# EAGLE design Serial Card V3 (EAGLE 6.6.0)
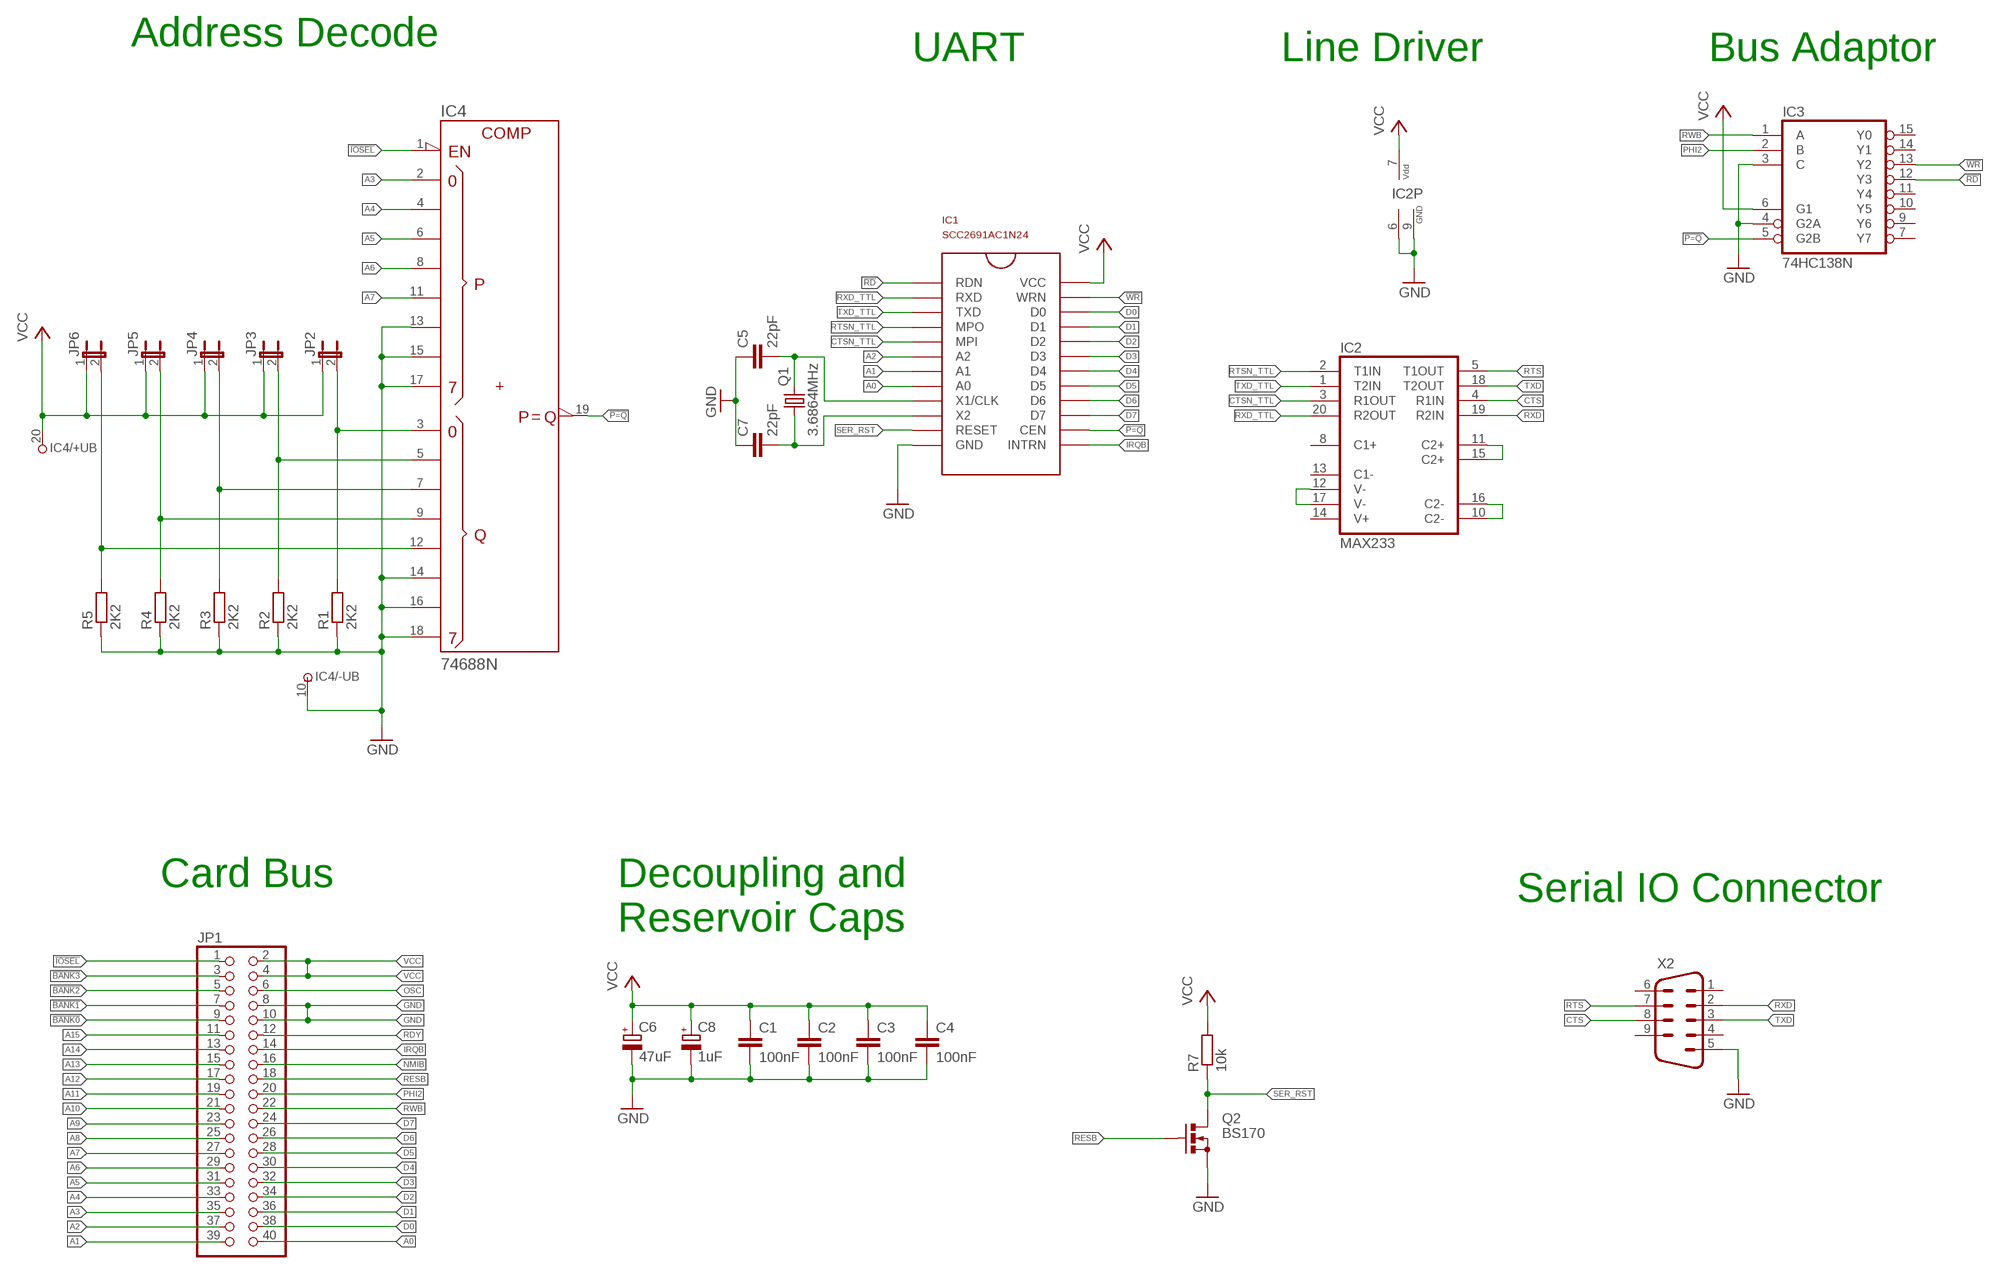
[diagram p0: schematic, sheet 1]

## Parts
C1  100nF  C-EU050-025X075  [C050-025X075]
C2  100nF  C-EU050-025X075  [C050-025X075]
C3  100nF  C-EU050-025X075  [C050-025X075]
C4  100nF  C-EU050-025X075  [C050-025X075]
C5  22pF  C-EU025-024X044  [C025-024X044]
C6  47uF  CPOL-EUE2.5-7  [E2,5-7]
C7  22pF  C-EU025-024X044  [C025-024X044]
C8  1uF  CPOL-EUE5-5  [E5-5]
IC1  SCC2691AC1N24  [DIP]
IC2  MAX233  [DIL20]
IC3  74HC138N  [DIL16]
IC4  74688N  [DIL20]
JP1  PINHD-2X20/90  [2X20/90]
JP2  JP1E  [JP1]
JP3  JP1E  [JP1]
JP4  JP1E  [JP1]
JP5  JP1E  [JP1]
JP6  JP1E  [JP1]
Q1  3.6864MHz  CRYSTALHC49S  [HC49/S]
Q2  BS170  [SOT54E]
R1  2K2  R-EU_0207/2V  [0207/2V]
R2  2K2  R-EU_0207/2V  [0207/2V]
R3  2K2  R-EU_0207/2V  [0207/2V]
R4  2K2  R-EU_0207/2V  [0207/2V]
R5  2K2  R-EU_0207/2V  [0207/2V]
R7  10k  R-EU_0207/2V  [0207/2V]
X2  M09HP  [M09HP]

## Nets
!BANK0: JP1.9
!BANK1: JP1.7
!BANK2: JP1.5
!BANK3: JP1.3
!IOSEL: IC4.1(!G) JP1.1
!P=Q: IC1.CEN IC3.5(G2B) IC4.19(!P=Q)
!RD: IC1.RDN IC3.12(Y3)
!WR: IC1.WRN IC3.13(Y2)
A0: IC1.A0 JP1.40
A1: IC1.A1 JP1.39
A2: IC1.A2 JP1.37
A3: IC4.2(P0) JP1.35
A4: IC4.4(P1) JP1.33
A5: IC4.6(P2) JP1.31
A6: IC4.8(P3) JP1.29
A7: IC4.11(P4) JP1.27
A8: JP1.25
A9: JP1.23
A10: JP1.21
A11: JP1.19
A12: JP1.17
A13: JP1.15
A14: JP1.13
A15: JP1.11
CTS: IC2.4(R1IN) X2.8
CTSN_TTL: IC1.MPI IC2.3(R1OUT)
D0: IC1.D0 JP1.38
D1: IC1.D1 JP1.36
D2: IC1.D2 JP1.34
D3: IC1.D3 JP1.32
D4: IC1.D4 JP1.30
D5: IC1.D5 JP1.28
D6: IC1.D6 JP1.26
D7: IC1.D7 JP1.24
GND: C1.2 C2.2 C3.2 C4.2 C5.1 C6.- C7.1 C8.- IC1.GND IC2.6(GND) IC2.9(GND) IC3.3(C) IC3.4(G2A) IC4.10(-UB) IC4.13(P5) IC4.14(Q5) IC4.15(P6) IC4.16(Q6) IC4.17(P7) IC4.18(Q7) JP1.8 JP1.10 Q2.S R1.1 R2.1 R3.1 R4.1 R5.1 X2.5
IRQB: IC1.INTRN JP1.14
N$1: C5.2 IC1.X1/CLK Q1.2
N$2: C7.2 IC1.X2 Q1.1
N$7: IC4.3(Q0) JP2.2 R1.2
N$8: IC4.5(Q1) JP3.2 R2.2
N$10: IC4.7(Q2) JP4.2 R3.2
N$11: IC4.9(Q3) JP5.2 R4.2
N$12: IC4.12(Q4) JP6.2 R5.2
N$16: IC2.11(C2+) IC2.15(C2+)
N$17: IC2.10(C2-) IC2.16(C2-)
N$18: IC2.12(V-) IC2.17(V-)
NMIB: JP1.16
OSC: JP1.6
PHI2: IC3.2(B) JP1.20
RDY: JP1.12
RESB: JP1.18 Q2.G
RTS: IC2.5(T1OUT) X2.7
RTSN_TTL: IC1.MPO IC2.2(T1IN)
RWB: IC3.1(A) JP1.22
RXD: IC2.19(R2IN) X2.2
RXD_TTL: IC1.RXD IC2.20(R2OUT)
SER_RST: IC1.RESET Q2.D R7.1
TXD: IC2.18(T2OUT) X2.3
TXD_TTL: IC1.TXD IC2.1(T2IN)
VCC: C1.1 C2.1 C3.1 C4.1 C6.+ C8.+ IC1.VCC IC2.7(VDD) IC3.6(G1) IC4.20(+UB) JP1.2 JP1.4 JP2.1 JP3.1 JP4.1 JP5.1 JP6.1 R7.2
Unconnected: IC2.8(C1+) IC2.13(C1-) IC2.14(V+) IC3.7(Y7) IC3.9(Y6) IC3.10(Y5) IC3.11(Y4) IC3.14(Y1) IC3.15(Y0) X2.1 X2.4 X2.6 X2.9

## Notes on the sheet
- Address Decode
- UART | Line Driver | Bus Adaptor
- Card Bus
- Serial IO Connector
- Decoupling and
  Reservoir Caps

## Power pins joined to a net without a drawn wire
GND: IC3.8(GND)
VCC: IC3.16(VCC)

## Library data of the parts
C1-C5 C7 = rcl:C-EU: CAPACITOR, European symbol
C6 C8 = rcl:CPOL-EU: POLARIZED CAPACITOR, European symbol
IC1 = Duncs Philips:SCC2691AC1N24: Universal Asynchronous Receiver/Transmitter Parallel bus based UART with upto 115.2kbits/second data rate.
IC2 = maxim:MAX233: RS232 TRANSEIVER
IC3 = 74xx-eu:74*138: 3-line to 8-line DECODER/DEMULTIPLEXER
IC4 = 74ttl-din:74*688: 8-bit MAGNITUDE/IDENTITY COMPARATOR, totem pole
JP1 = pinhead:PINHD-2X20: PIN HEADER
JP2-JP6 = jumper:JP1E: JUMPER
Q1 = crystal:CRYSTAL: CRYSTAL; OC_FARNELL: 1667008; OC_NEWARK: unknown
Q2 = transistor-small-signal:BS170: N-CHANNEL MOS FET
R1-R5 R7 = rcl:R-EU_: RESISTOR, European symbol
X2 = con-subd:M09: SUB-D; OC_FARNELL: unknown; OC_NEWARK: unknown

## Board
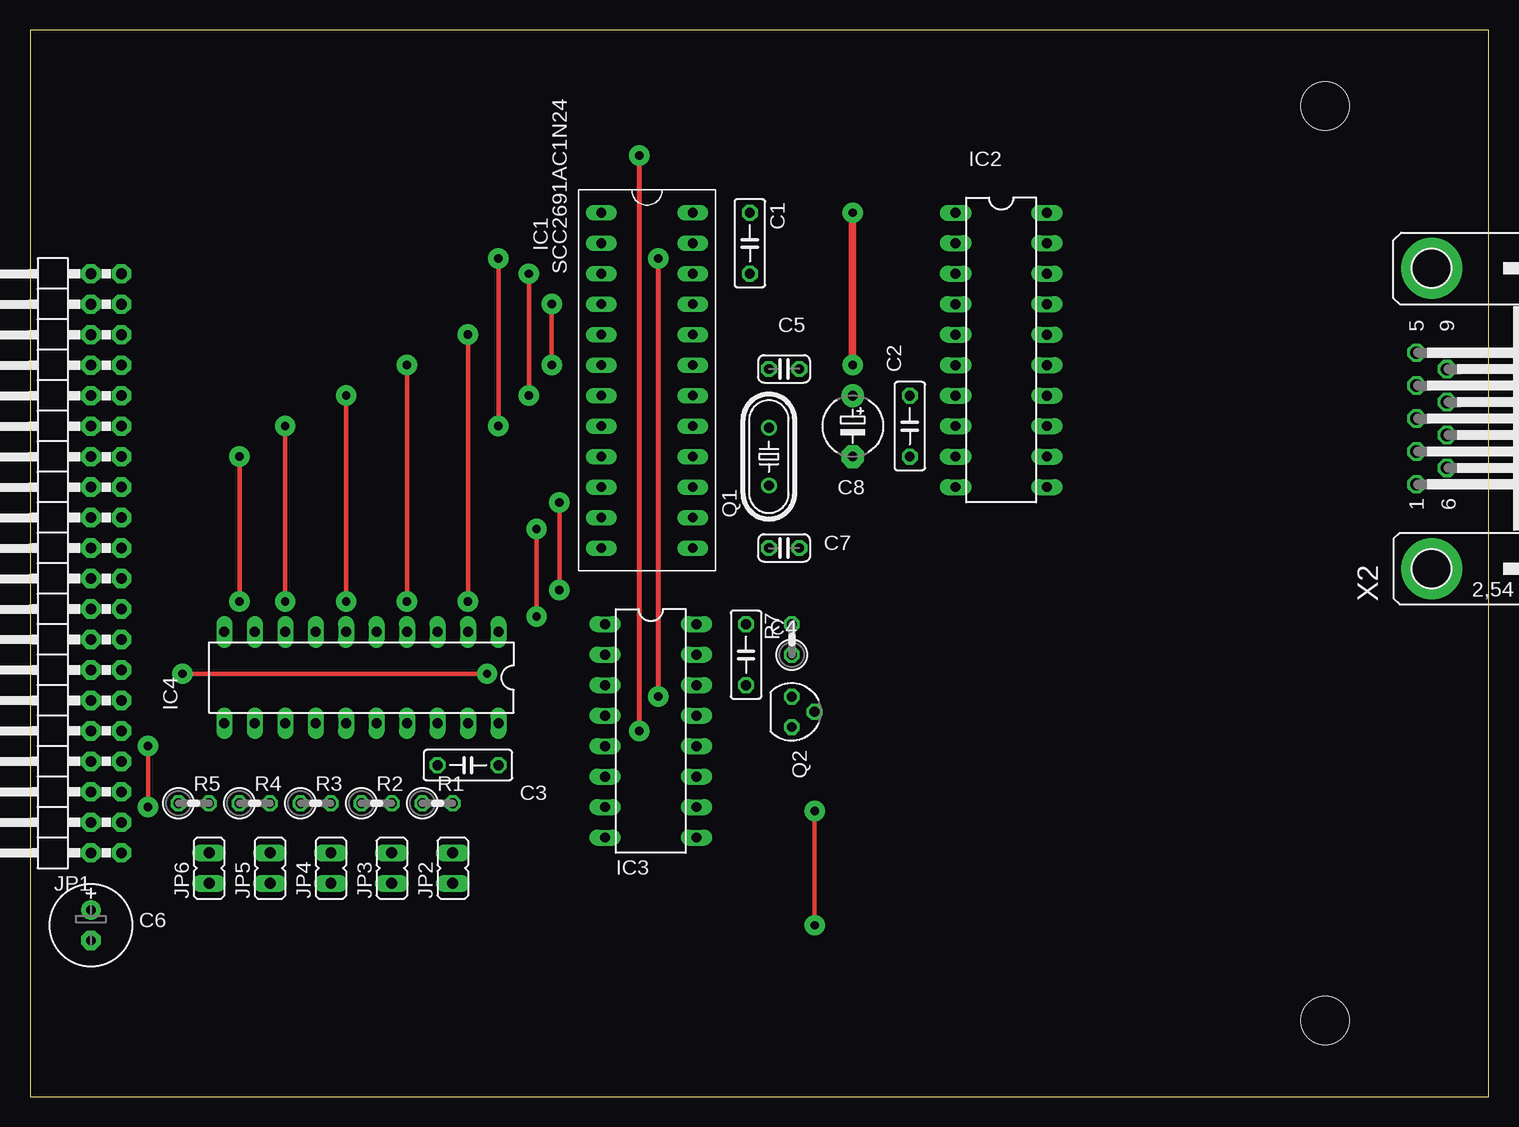
[diagram p1: board, top side]
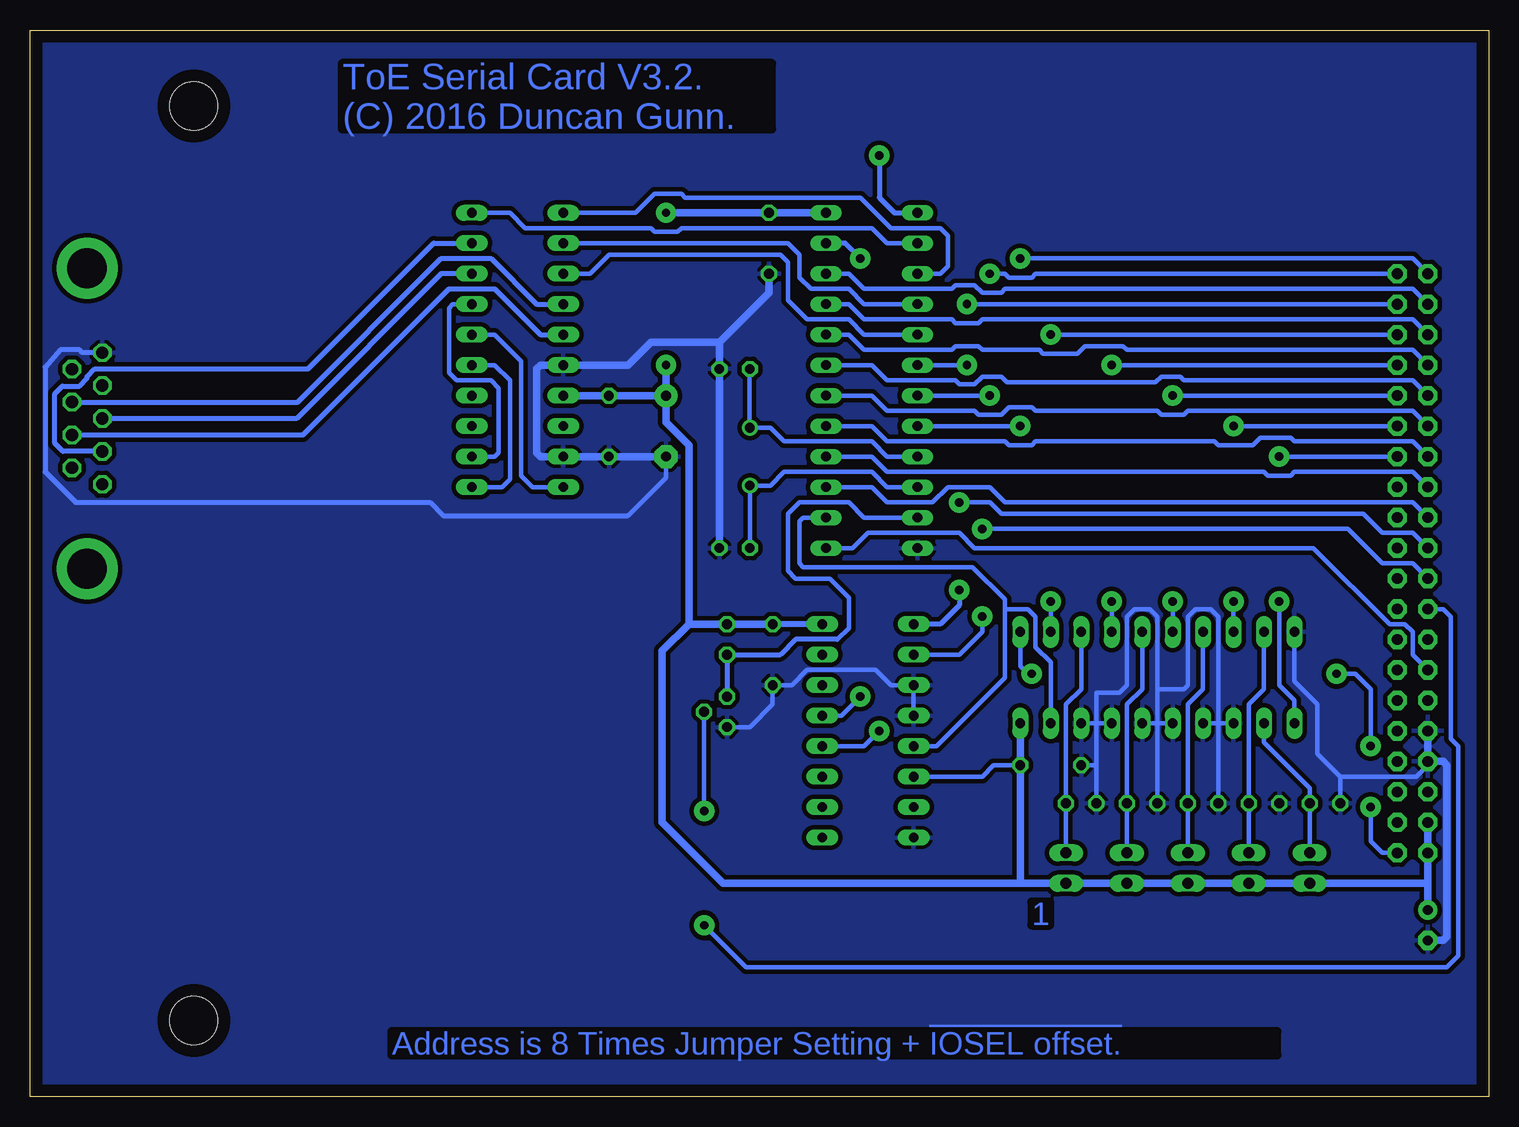
[diagram p2: board, bottom side, seen from below]

Size 121.6 x 88.89 mm. Coordinates in mm from the lower left corner, seen from the top.
Outline: 0,0 121.6,0 121.6,88.89 0,88.89 0,0
Copper layers (1*16): Top 0.035mm / dielectric 1.5mm / Bottom 0.035mm
Design rules "default *": minimum track width 10mil, minimum drill 24mil, track to track 8mil, track to pad 8mil, pad to pad 8mil, via to via 8mil, smd to smd 8mil, copper to edge 40mil, drill to drill 8mil, minimum pad ring 10mil, minimum via ring 8mil, stop-mask expansion 4mil, vias tented up to drill 0mil, thermal gap 12mil
Holes 4 mm at 107.95,82.55 107.95,6.35

### Footprints (pad centres in the part's own frame; a part is rotated, then mirrored left to right if it is on the bottom)
C050-025X075 = drill 0.813 octagon: 1 -2.54,0; 2 2.54,0
C025-024X044 = drill 0.813 octagon: 1 -1.27,0; 2 1.27,0
E2,5-7 = drill 0.813 pad 1.6: + -1.27,0 | drill 0.813 pad 1.6 octagon: - 1.27,0
E5-5 = drill 0.813 pad 1.905: + -2.54,0 | drill 0.813 pad 1.905 octagon: - 2.54,0
DIP = drill 0.8 long: A0 -3.81,-5.08; A1 -3.81,-2.54; A2 -3.81,0; CEN 3.81,-12.7; D0 3.81,7.62; D1 3.81,5.08; D2 3.81,2.54; D3 3.81,0; D4 3.81,-2.54; D5 3.81,-5.08; D6 3.81,-7.62; D7 3.81,-10.16; GND -3.81,-15.24; INTRN 3.81,-15.24; MPI -3.81,2.54; MPO -3.81,5.08; RDN -3.81,12.7; RESET -3.81,-12.7; RXD -3.81,10.16; TXD -3.81,7.62; VCC 3.81,12.7; WRN 3.81,10.16; X1/CLK -3.81,-7.62; X2 -3.81,-10.16
DIL20 = drill 0.813 long: 1 -11.43,-3.81; 2 -8.89,-3.81; 3 -6.35,-3.81; 4 -3.81,-3.81; 5 -1.27,-3.81; 6 1.27,-3.81; 7 3.81,-3.81; 8 6.35,-3.81; 9 8.89,-3.81; 10 11.43,-3.81; 11 11.43,3.81; 12 8.89,3.81; 13 6.35,3.81; 14 3.81,3.81; 15 1.27,3.81; 16 -1.27,3.81; 17 -3.81,3.81; 18 -6.35,3.81; 19 -8.89,3.81; 20 -11.43,3.81
DIL16 = drill 0.813 long: 1 -8.89,-3.81; 2 -6.35,-3.81; 3 -3.81,-3.81; 4 -1.27,-3.81; 5 1.27,-3.81; 6 3.81,-3.81; 7 6.35,-3.81; 8 8.89,-3.81; 9 8.89,3.81; 10 6.35,3.81; 11 3.81,3.81; 12 1.27,3.81; 13 -1.27,3.81; 14 -3.81,3.81; 15 -6.35,3.81; 16 -8.89,3.81
2X20/90 = drill 0.889 pad 1.6 octagon: 1 -24.13,-6.35; 2 -24.13,-3.81; 3 -21.59,-6.35; 4 -21.59,-3.81; 5 -19.05,-6.35; 6 -19.05,-3.81; 7 -16.51,-6.35; 8 -16.51,-3.81; 9 -13.97,-6.35; 10 -13.97,-3.81; 11 -11.43,-6.35; 12 -11.43,-3.81; 13 -8.89,-6.35; 14 -8.89,-3.81; 15 -6.35,-6.35; 16 -6.35,-3.81; 17 -3.81,-6.35; 18 -3.81,-3.81; 19 -1.27,-6.35; 20 -1.27,-3.81; 21 1.27,-6.35; 22 1.27,-3.81; 23 3.81,-6.35; 24 3.81,-3.81; 25 6.35,-6.35; 26 6.35,-3.81; 27 8.89,-6.35; 28 8.89,-3.81; 29 11.43,-6.35; 30 11.43,-3.81; 31 13.97,-6.35; 32 13.97,-3.81; 33 16.51,-6.35; 34 16.51,-3.81; 35 19.05,-6.35; 36 19.05,-3.81; 37 21.59,-6.35; 38 21.59,-3.81; 39 24.13,-6.35; 40 24.13,-3.81
JP1 = drill 0.914 long: 1 0,-1.27; 2 0,1.27
HC49/S = drill 0.813: 1 -2.413,0; 2 2.413,0
SOT54E = drill 0.813 octagon: D -1.27,0; G 0,1.905; S 1.27,0
0207/2V = drill 0.813 octagon: 1 -1.27,0; 2 1.27,0
M09HP = drill 1.016 octagon: 1 -5.486,1.27; 2 -2.743,1.27; 3 0,1.27; 4 2.743,1.27; 5 5.486,1.27; 6 -4.115,-1.27; 7 -1.372,-1.27; 8 1.372,-1.27; 9 4.115,-1.27 | drill 3.302 pad 5.08: G1 -12.522,0; G2 12.522,0

### Placement (x,y rotation side)
C1  60.01,71.12 270 top
C2  73.34,55.88 270 top
C3  36.51,27.62 180 top
C4  59.69,36.83 270 top
C5  62.87,60.64 180 top
C6  5.08,14.29 270 top
C7  62.87,45.72 180 top
C8  68.58,55.88 270 top
IC1  51.44,60.96 0 top
IC2  80.96,62.23 270 top
IC3  51.75,30.48 270 top
IC4  27.62,34.92 180 top
JP1  1.27,44.45 90 top
JP2  35.24,19.05 0 top
JP3  30.16,19.05 0 top
JP4  25.08,19.05 0 top
JP5  20,19.05 0 top
JP6  14.92,19.05 0 top
Q1  61.59,53.34 90 top
Q2  63.5,32.07 270 top
R1  33.97,24.45 0 top
R2  28.89,24.45 0 top
R3  23.81,24.45 0 top
R4  18.73,24.45 0 top
R5  13.65,24.45 0 top
R7  63.5,38.1 90 top
X2  116.84,56.52 90 top

### Tracks (layer width: path | path; a pad name or v marks a point on that pad's centre or on a via)
!IOSEL  (via drill 0.7 pad 1.7)
  Top 0.356: v9.84,24.13 v9.84,29.21 | v12.7,35.24 v38.1,35.24
  Bottom 0.356: JP1.1 8.89,20.32 9.84,21.27 v9.84,24.13 | v9.84,29.21 9.84,33.97 11.11,35.24 v12.7,35.24 | IC4.1 39.05,35.88 38.42,35.24 v38.1,35.24
!P=Q
  Bottom 0.356: IC1.CEN 57.15,48.26 57.47,47.94 57.47,44.45 57.15,44.13 43.02,44.13 40.32,41.43 40.32,40.64 | IC4.19 36.51,36.2 37.78,37.47 37.78,40.01 38.42,40.64 40.32,40.64 | IC3.5 46.04,29.21 40.32,34.92 40.32,40.64
!RD  (via drill 0.7 pad 1.7)
  Top 0.406: v50.8,30.48 v50.8,78.42
  Bottom 0.356: IC3.12 52.07,29.21 v50.8,30.48
  Bottom 0.406: v50.8,78.42 50.8,74.93 49.53,73.66 IC1.RDN
!WR  (via drill 0.7 pad 1.7)
  Top 0.406: v52.39,33.34 v52.39,69.85
  Bottom 0.356: IC3.13 53.98,31.75 v52.39,33.34
  Bottom 0.406: v52.39,69.85 53.66,71.12 IC1.WRN
A0  (via drill 0.7 pad 1.7)
  Top 0.356: v39.05,55.88 v39.05,69.85
  Bottom 0.356: IC1.A0 v39.05,55.88 | v39.05,69.85 6.35,69.85 JP1.40
A1  (via drill 0.7 pad 1.7)
  Top 0.356: v41.59,58.42 v41.59,68.58
  Bottom 0.356: IC1.A1 v41.59,58.42 | v41.59,68.58 40.32,68.58 40.01,68.26 38.1,68.26 37.78,68.58 JP1.39
A2  (via drill 0.7 pad 1.7)
  Top 0.356: v43.5,60.96 v43.5,66.04
  Bottom 0.356: IC1.A2 v43.5,60.96 | v43.5,66.04 JP1.37
A3  (via drill 0.7 pad 1.7)
  Top 0.356: v36.51,63.5 v36.51,41.27
  Bottom 0.356: JP1.35 v36.51,63.5 | v36.51,41.27 IC4.2
A4  (via drill 0.7 pad 1.7)
  Top 0.356: v31.43,60.96 v31.43,41.27
  Bottom 0.356: JP1.33 v31.43,60.96 | v31.43,41.27 IC4.4
A5  (via drill 0.7 pad 1.7)
  Top 0.356: v26.35,58.42 v26.35,41.27
  Bottom 0.356: JP1.31 v26.35,58.42 | v26.35,41.27 IC4.6
A6  (via drill 0.7 pad 1.7)
  Top 0.356: v21.27,55.88 v21.27,41.27
  Bottom 0.356: JP1.29 v21.27,55.88 | v21.27,41.27 IC4.8
A7  (via drill 0.7 pad 1.7)
  Top 0.356: v17.46,53.34 v17.46,41.27
  Bottom 0.356: JP1.27 v17.46,53.34 | v17.46,41.27 17.46,34.29 16.19,33.02 IC4.11
CTS
  Bottom 0.406: X2.8 99.28,57.89 87.31,69.85 83.19,69.85 79.38,66.04 IC2.4
CTSN_TTL
  Bottom 0.356: IC1.MPI 52.07,63.5 53.34,64.77 56.83,64.77 58.42,66.36 58.42,69.53 59.05,70.17 73.34,70.17 74.93,68.58 IC2.3
D0
  Bottom 0.356: IC1.D0 53.34,68.58 52.07,67.31 44.77,67.31 44.45,67.63 42.86,67.63 42.23,66.99 40.64,66.99 40.32,67.31 6.35,67.31 JP1.38
D1
  Bottom 0.356: IC1.D1 53.34,66.04 52.07,64.77 44.77,64.77 44.45,64.45 42.55,64.45 42.23,64.77 6.35,64.77 JP1.36
D2
  Bottom 0.356: IC1.D2 53.34,63.5 52.07,62.23 44.77,62.23 44.45,62.55 42.55,62.55 42.23,62.23 37.47,62.23 37.15,61.91 34.29,61.91 33.66,62.55 30.48,62.55 30.16,62.23 6.35,62.23 JP1.34
D3
  Bottom 0.356: IC1.D3 51.44,60.96 50.16,59.69 44.45,59.69 44.13,59.37 42.86,59.37 42.23,60.01 40.64,60.01 40.16,59.53 27.78,59.53 27.3,60.01 25.72,60.01 25.4,59.69 6.35,59.69 JP1.32
D4
  Bottom 0.356: IC1.D4 51.44,58.42 50.16,57.15 42.86,57.15 42.55,56.83 40.64,56.83 40.01,57.47 38.1,57.47 37.78,57.15 27.62,57.15 27.3,56.83 25.4,56.83 25.08,57.15 6.35,57.15 JP1.30
D5
  Bottom 0.356: IC1.D5 51.44,55.88 50.16,54.61 40.32,54.61 40.01,54.29 38.1,54.29 37.78,54.61 22.86,54.61 22.54,54.29 19.68,54.29 19.05,54.93 16.51,54.93 16.19,54.61 6.35,54.61 JP1.28
D6
  Bottom 0.356: IC1.D6 51.44,53.34 50.16,52.07 18.73,52.07 18.41,51.75 16.51,51.75 16.19,52.07 6.35,52.07 JP1.26
D7
  Bottom 0.356: IC1.D7 51.44,50.8 50.16,49.53 46.35,49.53 45.09,50.8 41.59,50.8 40.32,49.53 6.35,49.53 JP1.24
GND
  Bottom 0.356: R1.1 32.7,27.62 | 32.7,27.62 32.7,31.11 | 27.62,31.11 R2.1 | IC4.15 27.62,31.11 | IC4.17 32.7,31.11 | IC4.13 22.54,31.11 | 22.54,31.11 R3.1 | IC4.10 16.19,34.61 14.29,32.7 14.29,28.57 12.38,26.67 | 12.38,26.67 R5.1 | JP1.8 5.08,27.62 6.03,26.67 12.38,26.67 | C3.2 32.7,27.62 | C8.- 68.58,51.59 71.75,48.42 | IC3.4 IC3.3 49.85,34.29 51.12,35.56 56.83,35.56 58.1,34.29 C4.2 59.69,32.7 61.59,30.8 Q2.S | IC4.14 22.54,31.11 | 22.54,31.11 22.54,40.01 23.18,40.64 24.45,40.64 25.08,40.01 25.08,34.29 25.4,33.97 27.62,33.97 | IC4.16 27.62,31.11 | 27.62,31.11 27.62,33.97 | 27.62,33.97 27.62,40.01 28.26,40.64 29.53,40.64 30.16,40.01 30.16,34.29 30.8,33.66 32.7,33.66 32.7,31.11 | IC4.18 32.7,31.11
  Bottom 0.406: X2.5 117.25,62 117.47,62.23 119.06,62.23 120.33,60.8 120.33,52.07 117.79,49.53 88.27,49.53 87.15,48.42 71.75,48.42
  Bottom 0.61: JP1.10 JP1.8 3.81,27.94 3.49,27.62 3.49,13.34 3.81,13.02 C6.- | C8.- C2.2 IC2.9 79.06,53.34 79.38,53.66 79.38,60.64 79.06,60.96 IC2.6 71.75,60.96 69.85,62.87 64.14,62.87 | C7.1 C5.1 64.14,62.87 | C1.2 60.01,66.99 64.14,62.87
  pour Bottom (isolate 0.381): 0,88.9 0,0 121.6,0 121.6,88.9
IRQB
  Bottom 0.356: JP1.14 6.35,36.83 6.35,38.73 6.99,39.37 8.26,39.37 14.61,45.72 42.86,45.72 44.13,46.99 51.75,46.99 53.02,45.72 IC1.INTRN
N$1
  Bottom 0.356: IC1.X1/CLK 50.16,53.34 51.44,54.61 58.74,54.61 59.88,55.75 Q1.2 61.63,56.86 61.63,60.61 C5.2
N$2
  Bottom 0.356: IC1.X2 50.16,50.8 51.44,52.07 58.74,52.07 59.88,50.93 Q1.1 C7.2
N$7
  Bottom 0.356: IC4.3 33.97,33.97 35.24,32.7 R1.2 JP2.2
N$8
  Bottom 0.356: IC4.5 28.89,33.97 30.16,32.7 R2.2 JP3.2
N$10
  Bottom 0.356: IC4.7 23.81,33.97 25.08,32.7 R3.2 JP4.2
N$11
  Bottom 0.356: IC4.9 18.73,33.97 20,32.7 R4.2 JP5.2
N$12
  Bottom 0.356: IC4.12 18.73,29.53 14.92,25.72 R5.2 JP6.2
N$16
  Bottom 0.356: IC2.15 82.87,60.96 81.6,59.69 81.6,51.44 82.23,50.8 IC2.11
N$17
  Bottom 0.356: IC2.10 79.69,50.8 80.64,51.75 80.64,61.28 82.87,63.5 IC2.16
N$18
  Bottom 0.356: IC2.17 86.36,66.04 86.68,65.72 86.68,60.33 86.04,59.69 83.19,59.69 82.55,59.05 82.55,53.66 82.87,53.34 IC2.12
PHI2  (via drill 0.7 pad 1.7)
  Top 0.356: v42.23,47.31 v42.23,40.01
  Bottom 0.356: JP1.20 6.35,44.45 8.89,44.45 11.75,47.31 v42.23,47.31 | v42.23,40.01 42.23,38.73 44.13,36.83 IC3.2
RESB  (via drill 0.7 pad 1.7)
  Top 0.356: v65.41,14.29 v65.41,23.81
  Bottom 0.356: JP1.18 3.81,40.64 3.17,40.01 3.17,29.84 2.54,29.21 2.54,11.75 3.49,10.79 61.91,10.79 v65.41,14.29 | v65.41,23.81 Q2.G
RTS
  Bottom 0.406: X2.7 98.84,55.14 86.68,67.31 82.87,67.31 79.06,63.5 IC2.5
RTSN_TTL
  Bottom 0.356: IC1.MPO 52.07,66.04 53.34,67.31 56.52,67.31 57.47,68.26 57.47,70.17 58.42,71.12 IC2.2
RWB  (via drill 0.7 pad 1.7)
  Top 0.356: v44.13,49.53 v44.13,42.23
  Bottom 0.356: JP1.22 6.35,46.99 8.89,46.99 10.48,48.58 40.64,48.58 41.59,49.53 v44.13,49.53
  Bottom 0.406: v44.13,42.23 44.13,40.96 45.72,39.37 IC3.1
RXD
  Bottom 0.406: X2.2 118.86,53.77 119.54,54.45 119.54,58.58 118.9,59.21 117.47,59.21 116.84,59.85 116.84,60.01 116.2,60.64 98.42,60.64 87.95,71.12 IC2.19
RXD_TTL
  Bottom 0.356: IC1.RXD 50.16,71.12 51.44,72.39 67.31,72.39 67.63,72.07 69.53,72.07 69.85,72.39 80.33,72.39 81.6,73.66 IC2.20
SER_RST
  Bottom 0.356: IC1.RESET 52.07,48.26 53.34,49.53 57.47,49.53 58.42,48.58 58.42,43.81 57.78,43.18 54.93,43.18 53.34,41.59 53.34,39.05 54.29,38.1
  Bottom 0.406: 54.29,38.1 57.78,38.1 59.05,36.83 R7.1 Q2.D
TXD
  Bottom 0.406: IC2.18 87.31,68.58 99.38,56.52 X2.3
TXD_TTL
  Bottom 0.356: IC1.TXD 45.72,68.58 45.09,69.22 45.09,71.75 45.72,72.39 49.85,72.39 52.39,74.93 66.99,74.93 67.31,75.25 69.53,75.25 71.12,73.66 IC2.1
VCC  (via drill 0.7 pad 1.7)
  Top 0.61: v68.58,73.66 v68.58,60.96
  Bottom 0.356: IC3.6 42.23,26.67 41.27,27.62 C3.1
  Bottom 0.508: IC3.16 C4.1
  Bottom 0.61: JP1.4 JP1.2 C6.+ 5.08,17.78 JP6.1 JP5.1 JP4.1 JP3.1 JP2.1 39.05,17.78 | 39.05,17.78 C3.1 IC4.20 | IC1.VCC C1.1 v68.58,73.66 | 39.05,17.78 63.82,17.78 68.9,22.86 68.9,37.15 66.67,39.37 | IC2.7 C2.1 C8.+ | C8.+ v68.58,60.96 | C8.+ 68.58,56.2 66.67,54.29 66.67,39.37 | C4.1 R7.2 66.67,39.37

### Text on the board
Bottom: ToE Serial Card V3.2. / (C) 2016 Duncan Gunn. | 1 | Address is 8 Times Jumper Setting + !IOSEL offset.